# Altium schematic sheet motorBoardSchematic1.SchDoc
size A; SheetNumber: 2; SheetTotal: 2
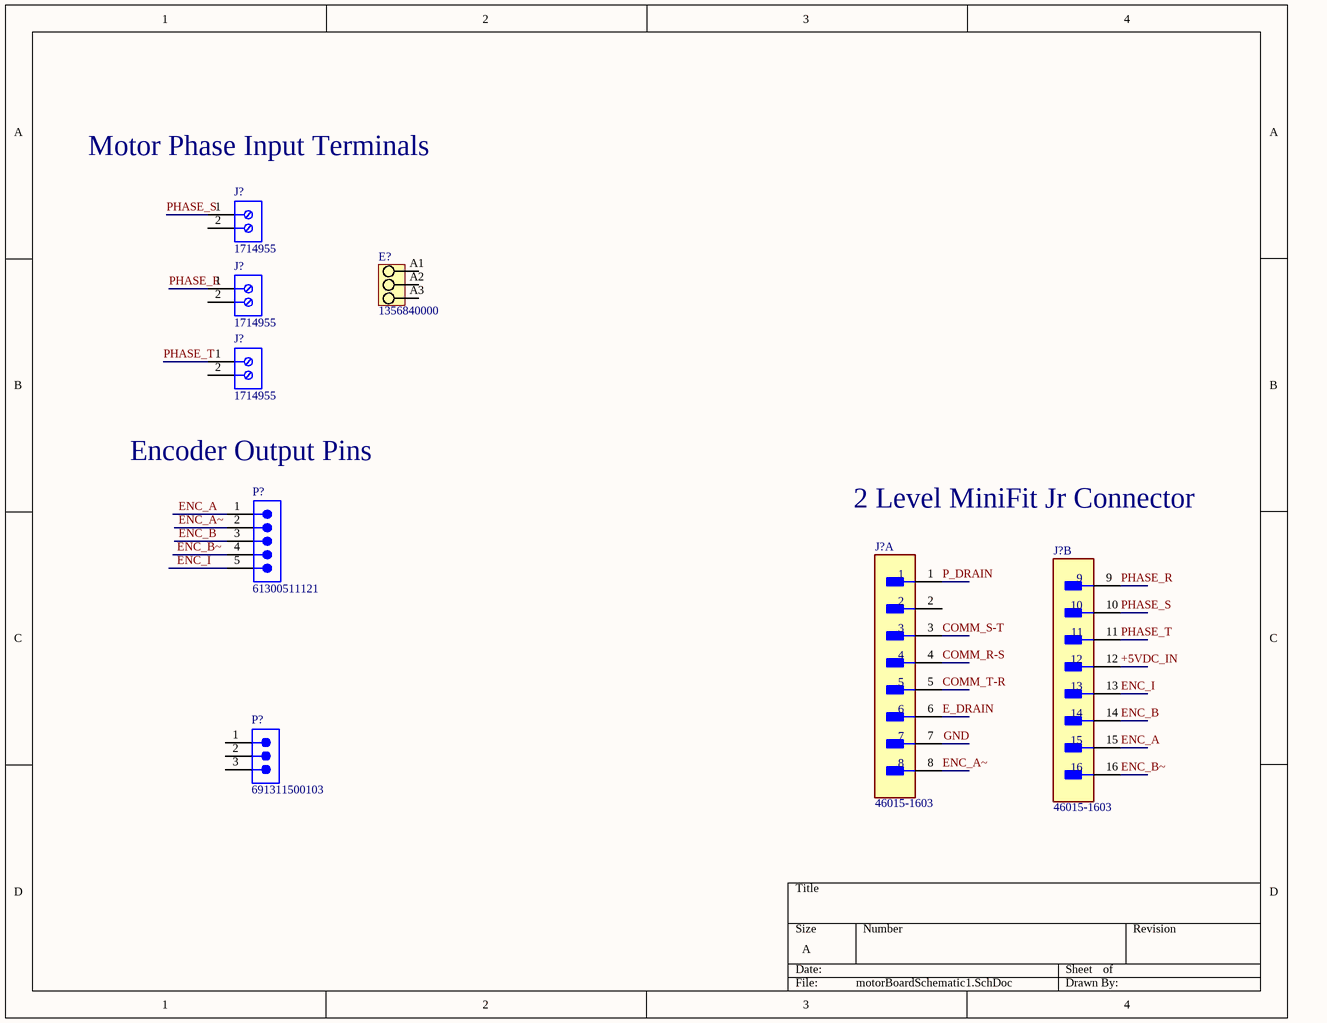
[diagram p0: motorBoardSchematic1.SchDoc]

## Parts
(Parts that share a designator on the sheet are numbered #1, #2 ... from top to bottom, then left to right.)
E?  1356840000  [LL_6_35_90V_03]
J?#1  1714955  [PHOE-1714955_V]
J?#2  1714955  [PHOE-1714955_V]
J?#3  1714955  [PHOE-1714955_V]
J?#4  46015-1603  [FP-46015-1603-MFG]  (part A of 2)
J?#5  46015-1603  [FP-46015-1603-MFG]  (part B of 2)
P?#1  61300511121  [61300511121]
P?#2  691311500103  [691311500103]

## Nets
+5VDC_IN: J?#5.12
COMM_R-S: J?#4.4
COMM_S-T: J?#4.3
COMM_T-R: J?#4.5
E_DRAIN: J?#4.6
ENC_A: J?#5.15 P?#1.1
ENC_A~: J?#4.8 P?#1.2
ENC_B: J?#5.14 P?#1.3
ENC_B~: J?#5.16 P?#1.4
ENC_I: J?#5.13 P?#1.5
GND: J?#4.7
P_DRAIN: J?#4.1
PHASE_R: J?#2.1 J?#5.9
PHASE_S: J?#1.1 J?#5.10
PHASE_T: J?#3.1 J?#5.11

Not connected (* = marked no-connect by the designer): E? A1 A2 A3; J?#1 2; J?#2 2; J?#3 2; J?#4 2; P?#2 1 2 3

## Notes on the sheet
- (near J?#1) Motor Phase Input Terminals
- Encoder Output Pins
- 2 Level MiniFit Jr Connector

## Library data of the parts
E? = CMP-1559-01677-1: OMNIMATE Signal - series LL; Manufacturer: Weidmueller; Short_text_for_material: LL 6.35/03/90V 5.0SN BK BX; Contact_material: Cu-Leg; Rated_voltage_for_surge_voltage_class_pollution_degree_II_2: 1000 V; Rated_current_min_no_of_poles_TU_20_deg_C: 32 A; Solid_min_H05_07_V_U: 0,18 mm²; Side_termination_characteristic: closed side; Rated_voltage_use_group_B_UL_1059: 600 V; Pitch_inch: 0,25 inch; Mounting_onto_the_PCB: Solder connection; Rated_current_use_group_B_UL_1059: 30 A; Contact_surface: tinned; UL_94_flammability_rating: V-0; Pitch_mm: 6,35 mm; Insulating_material: Wemid (PA); Wire_cross_section_AWG_min_UL_1059: AWG 26; No_of_poles: 3; Solid_max_H05_07_V_U: 6 mm²; Solder_pin_length_mm: 5 mm; Wire_cross_section_AWG_max_UL_1059: AWG 10; ComponentLink2Description: URL Link1; ComponentLink2URL: http://catalog.weidmueller.com/catalog/Start.do?localeId=en&ObjectID=1356840000; Qty: 50 PCS; Packaging: Box; PackageReference: LL_6_35_90V_03; ComponentLink1URL: http://www.weidmueller.com/; PartNumber: 1356840000; ComponentLink1Description: Manufacturer URL; Revision: V1; Colour: Black
J?#1-J?#3 = CMP-2000-05797-1: PC Terminal Block, Pitch 6.35 mm, 1 x 2 Position, Height 21.5 mm, Tail Lenght 5.1 mm, RoHS, Bulk; Manufacturer: Phoenix Contact; Package Description: PC Terminal Block, Pitch 6.35 mm, 1 x 2 Position, Height 21.5 mm, Tail Lenght 5.1 mm; Datasheet URL: http://media.digikey.com/pdf/Data%20Sheets/Phoenix%20Contact%20PDFs/1714955.pdf; Package Reference: 1714955; Manufacturer URL: http://www.phoenixcontact.com/; Datasheet Version: 02/2010; Mounting Technology: ThroughHole
J?#4 J?#5 = CMP-04776-001032-1: CONN HEADER VERT 16POS 4.2MM; Number of Circuits: 16; Current Rating: 13A; Glow Wire Compliant: Non-compliant; Voltage Rating: 600V; Orientation: Vertical; Package Quantity: 1920; Series: 46015; Contact Gender: Male; Contact Material: Copper Alloy; Radiation Hardening: No; Termination: Through Hole; Row Spacing: 4.2mm; Number of Contacts: 16; RoHS Compliant: Yes; Number of Rows: 2; Contact Plating: Tin; Weight: 0.119967oz; Housing Material: Nylon; Pitch: 4.2mm; Halogen Free: Low Halogen; Reach SVHC Compliant: Yes; Packaging: Tray; Number of Positions: 16
P?#1 = CMP-1502-01068-3: Encoder Output Headers; NexarPartId: 32855526; Connector Type: Male Pin; Gender: Male; Contact Resistance: 20mΩ; Pitch: 2.54mm; Operating Supply Voltage: 250V; Current Rating: 3A; Number of Contacts: 5; Lead Free: Lead Free; Color: Black; Packaging: Bulk; Lead Pitch: 2.54mm; Contact Material: Copper; Min Operating Temperature: -40°C; Contact Mating Length: 5.9944mm; Voltage Rating: 250V; Number of Pins: 5; Number of Positions: 5; Height: 8.89mm; Orientation: Vertical; REACH SVHC: Unknown; RoHS: Compliant; Contact Plating: Gold; Max Operating Temperature: 105°C; Mount: Through Hole; Number of Rows: 1; Termination: Solder
P?#2 = CMP-1502-02147-2: NexarPartId: 8917748; Current: 20A; Number of Positions Per Level: 3; Voltage: 300V; Gender: Male; Pitch: 5.08mm; Number of Levels: 1; REACH SVHC: Unknown; Contact Material: Brass; Number of Contacts: 3; Mount: Through Hole; Number of Pins: 3; Packaging: Box; Contact Plating: Tin; Height: 12mm; Termination: Solder; RoHS: Compliant; Color: Green; Number of Rows: 1; Width: 17.24mm; Lead Pitch: 5.08mm; Length: 8.5mm; Orientation: Vertical